# Altium schematic sheet Logic Level Shifting.SchDoc
size A; Engineer: Will Snyder; Revision: 1.0; SheetNumber: 5; SheetTotal: 5; DocumentTitle: 5V to 3V3 Logic Level Shifting
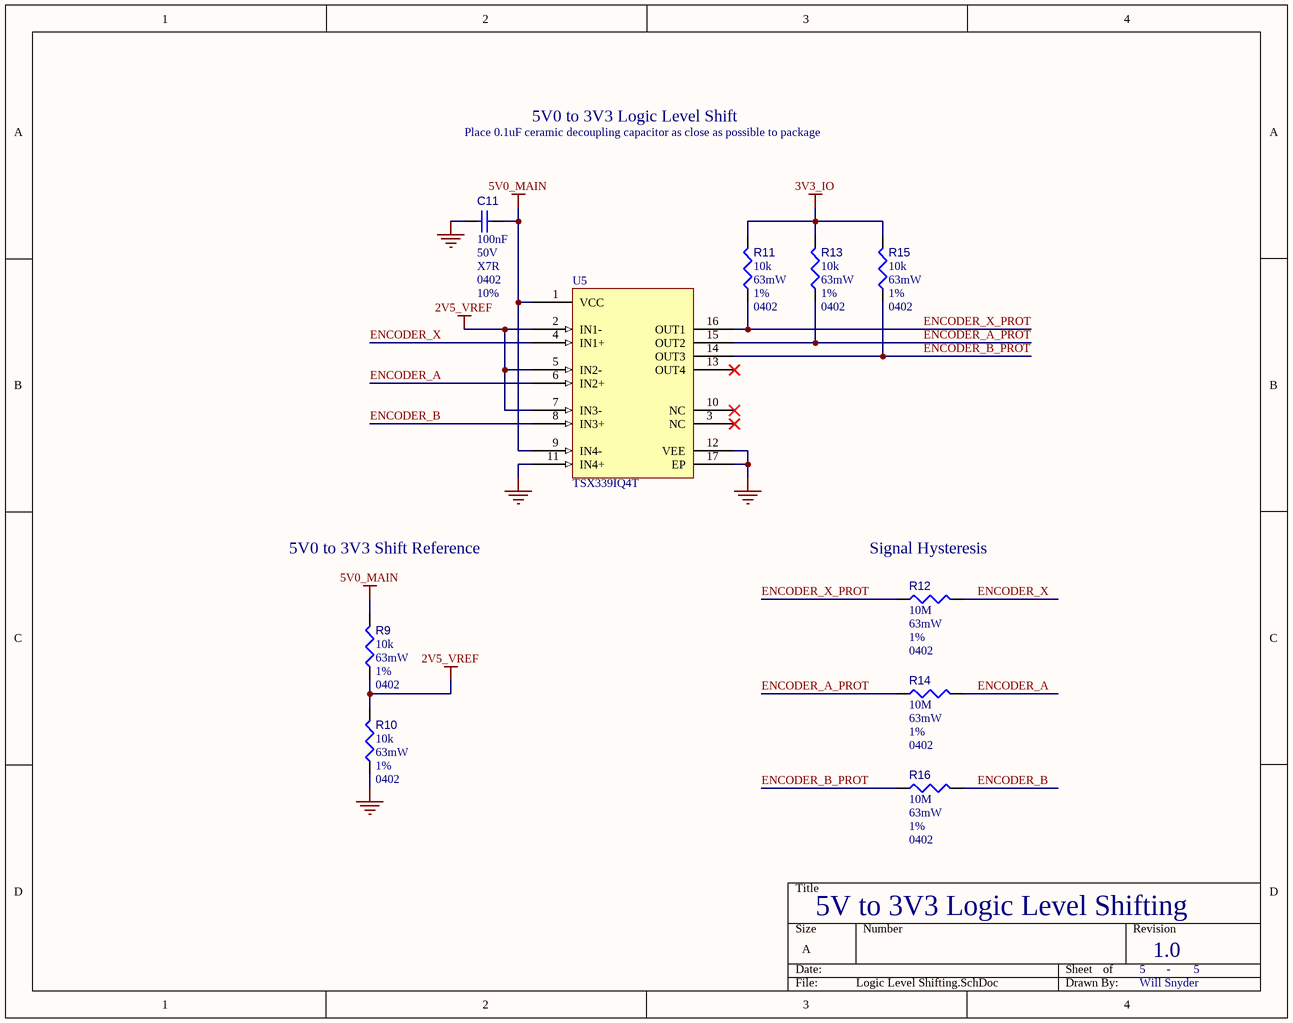
[diagram p0: Logic Level Shifting.SchDoc]

## Parts
C11  value 100nF  Voltage Rating: 50V  Capacitor Type: X7R  Case/Package: 0402  Tolerance: 10%  [CAPC1005X55X30NL05T10]  (hidden comment: 04025C104KAT4A)
R9  value 10k  Power: 63mW  Tolerance: 1%  Case/Package: 0402  [RESC1005X40X25NL05T05]  (hidden comment: MCS04020C5101FE000)
R10  value 10k  Power: 63mW  Tolerance: 1%  Case/Package: 0402  [RESC1005X40X25NL05T05]  (hidden comment: MCS04020C5101FE000)
R11  value 10k  Power: 63mW  Tolerance: 1%  Case/Package: 0402  [RESC1005X40X25NL05T05]  (hidden comment: MCS04020C5101FE000)
R12  value 10M  Power: 63mW  Tolerance: 1%  Case/Package: 0402  [RESC1005X40X25NL05T05]  (hidden comment: MCS04020C5101FE000)
R13  value 10k  Power: 63mW  Tolerance: 1%  Case/Package: 0402  [RESC1005X40X25NL05T05]  (hidden comment: MCS04020C5101FE000)
R14  value 10M  Power: 63mW  Tolerance: 1%  Case/Package: 0402  [RESC1005X40X25NL05T05]  (hidden comment: MCS04020C5101FE000)
R15  value 10k  Power: 63mW  Tolerance: 1%  Case/Package: 0402  [RESC1005X40X25NL05T05]  (hidden comment: MCS04020C5101FE000)
R16  value 10M  Power: 63mW  Tolerance: 1%  Case/Package: 0402  [RESC1005X40X25NL05T05]  (hidden comment: MCS04020C5101FE000)
U5  TSX339IQ4T  [QFN50P300X300X100-16N]

## Nets
2V5_VREF: R9.2 R10.1 U5.2(IN1-) U5.5(IN2-) U5.7(IN3-)
3V3_IO: R11.1 R13.1 R15.1
5V0_MAIN: C11.1 R9.1 U5.1(VCC) U5.9(IN4-)
GND: C11.2 R10.2 U5.11(IN4+) U5.12(VEE) U5.17(EP)
ENCODER_A: R14.1 U5.6(IN2+)
ENCODER_A_PROT: R13.2 R14.2 U5.15(OUT2)
ENCODER_B: R16.1 U5.8(IN3+)
ENCODER_B_PROT: R15.2 R16.2 U5.14(OUT3)
ENCODER_X: R12.1 U5.4(IN1+)
ENCODER_X_PROT: R11.2 R12.2 U5.16(OUT1)

Not connected (* = marked no-connect by the designer): U5 3(NC)* 10(NC)* 13(OUT4)*

## Notes on the sheet
- Place 0.1uF ceramic decoupling capacitor as close as possible to package
- 5V0 to 3V3 Logic Level Shift
- 5V0 to 3V3 Shift Reference
- (near R12) Signal Hysteresis
- -

## Library data of the parts
C11 = CMP-001-00090-1: Ceramic Capacitor, Multilayer, Ceramic, 50V, 10% +Tol, 10% -Tol, X7R, 15% TC, 0.1uF, Surface Mount, 0402; Pins: 2; RoHS Compliant: Yes
R9-R16 = CMP-009-00205-1: Fixed Resistor, Thin Film, 0.063W, 5100ohm, 50V, 1% +/-Tol, 50ppm/Cel, Surface Mount, 0402; Min Operating Temperature: -55°C; Pins: 2; Max Operating Temperature: 125°C; Mounting Technology: Surface Mount; RoHS Compliant: Yes
U5 = CMP-016-00012-1: Comparator, 4 Func, 6000uV Offset-Max, 2500ns Response Time, CMOS; Nominal Supply Voltage: 3V; Min Operating Temperature: -40°C; RoHS Compliant: Yes; Max Operating Temperature: 125°C; Pins: 16; Case/Package: HVQCCN